# EasyEDA Pro project ProPrj_OrcaSDVX_电路.epro, board PCB4
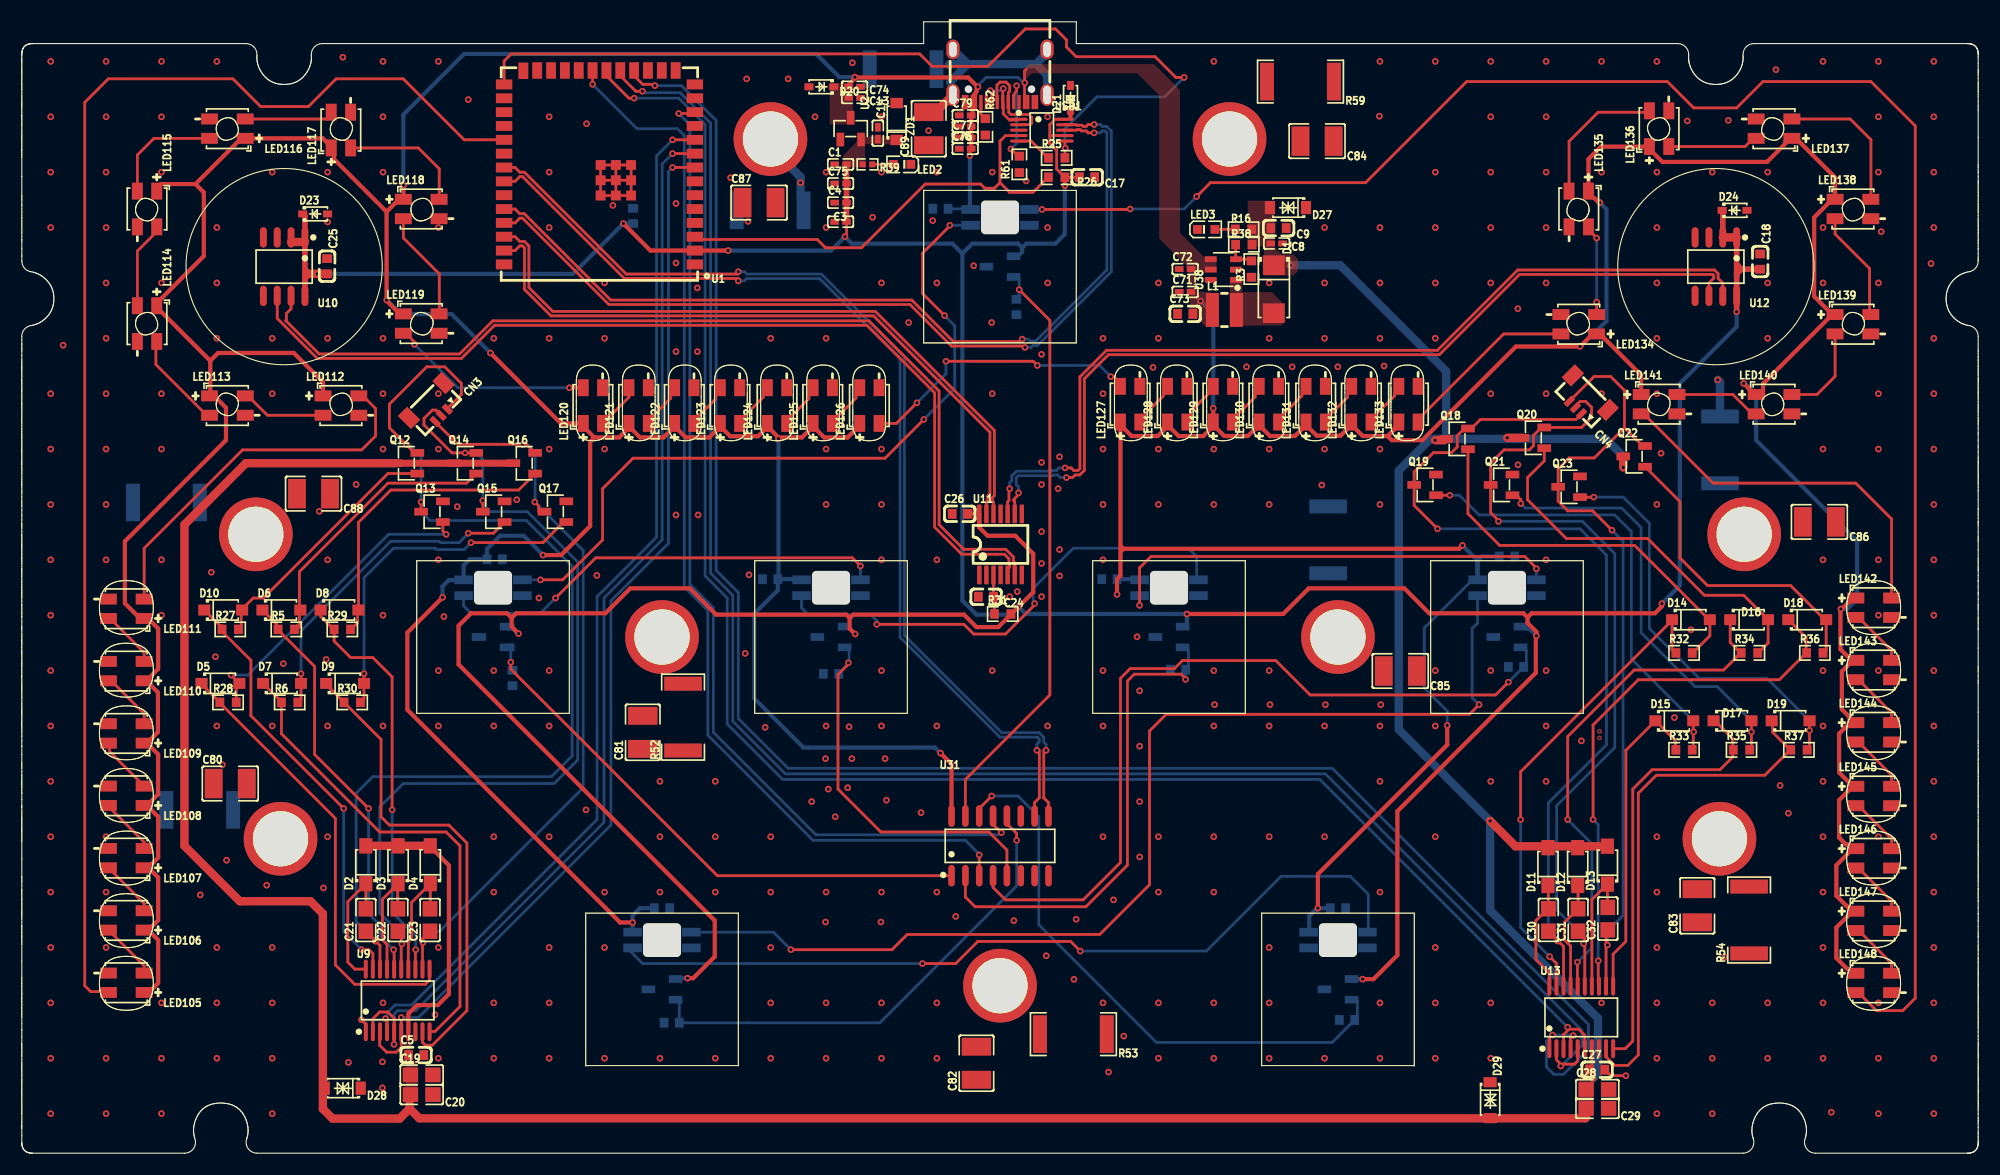
[diagram p3: board, top side]
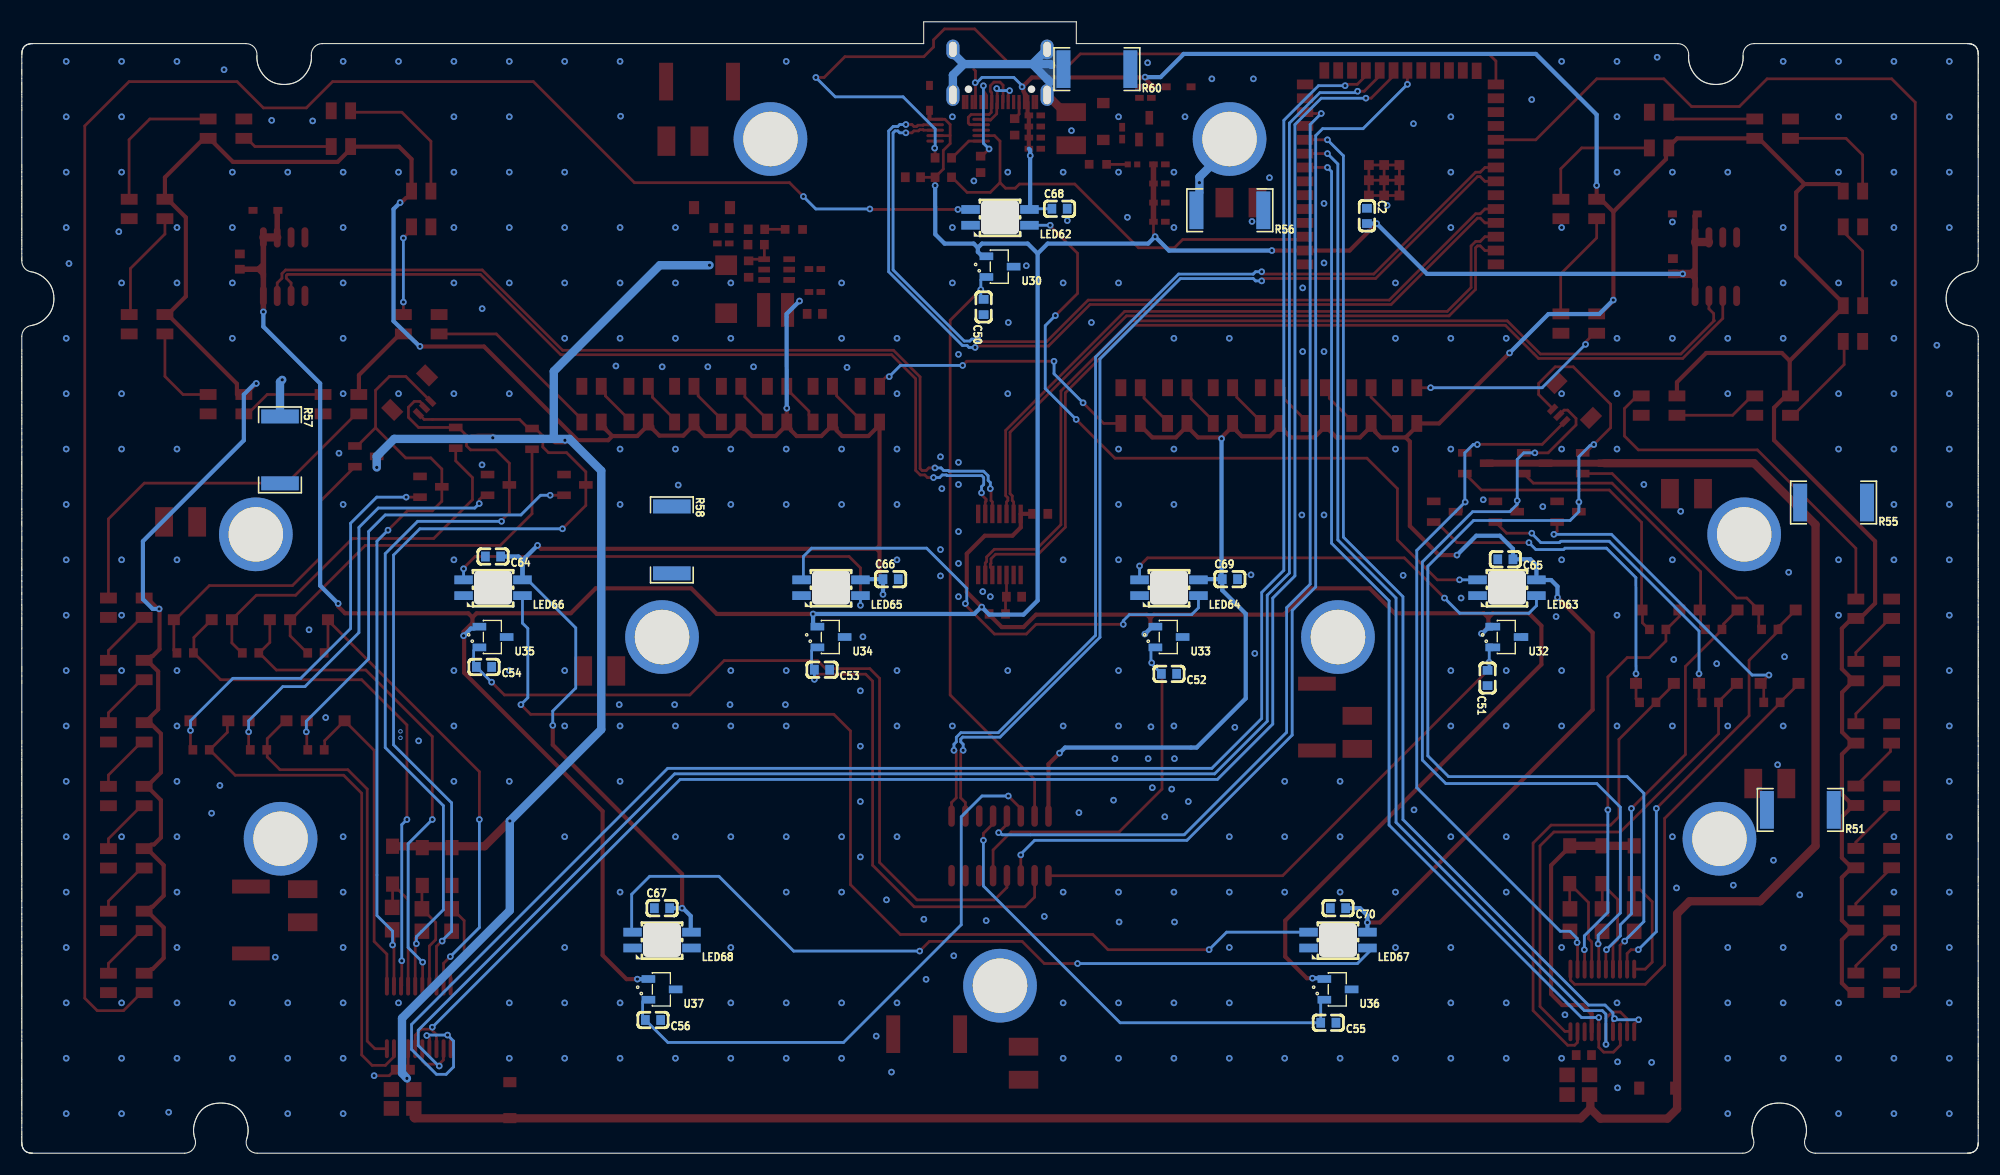
[diagram p4: board, bottom side, seen from below]

Outline 179.44 x 103.78 mm; copper layers: Top Layer, Bottom Layer. Coordinates in mm from the lower left corner of the outline.
Stack: Top Layer 0.035mm / Dielectric1 1.51mm FR4 er 4.5 / Bottom Layer 0.035mm

## Design rules (mm)
net SEL1: DP5
net SEL2: DP5
net RXD0: DP4
net TXD0: DP4
net SCL: DP1
net SDA: DP1
net SCL_0: DP3
net SDA_0: DP3
net SDA_1: DP2
net SCL_1: DP2
template: 自定义配置
spacing copperThickness1oz (default): track to track 0.102, other pairs 0.152 to 0.3
spacing copperThickness2oz: track to track 0.203, other pairs 0.152 to 0.3
track width copperThickness1oz (default): min 0.127, default 0.254, max 2.54
track width copperThickness2oz: min 0.203, default 0.254, max 2.54
differential pair differentialPair (default): width min 0.127, default 0.254, max 2.54; gap min 0.152, default 0.152
via viaSize (default): diameter min 0.5, default 0.61, max 10; hole min 0.3, default 0.305, max 6.299
net GND uses copperRegion2
net $1N114107 uses copperRegion2
net $1N114116 uses copperRegion2
net $1N114121 uses copperRegion2
net $1N114146 uses copperRegion2
net $1N114126 uses copperRegion2
net $1N114131 uses copperRegion2
net $1N114136 uses copperRegion2
net $1N114141 uses copperRegion2
pour e437 uses copperRegion2

## Placement (name value [footprint] x y rotation side)
C1  100nF  [C0402]  75.1 90.7 0 top
C2  100nF  [C0603]  56.06 85.98 270 bottom
C3  100nF  [C0402]  75.1 85.44 0 top
C4  100nF  [C0402]  75.1 87.19 0 top
C5  100nF  [C0603]  36.17 9 0 top
C8  100nF  [C0402]  115.1 83.45 180 top
C9  10uF  [C0603]  115.27 84.86 180 top
C13  100nF  [C0402]  76.38 96.8 180 top
C14  100nF  [C0402]  78.52 93.57 270 top
C17  100nF  [C0603]  97.71 89.52 180 top
C18  100nF  [C0603]  159.44 81.78 270 top
C19  22uF  [C0805]  36.68 7.18 0 top
C20  22uF  [C0805]  36.68 5.38 180 top
C21  22uF  [C0805]  31.55 21.39 90 top
C22  22uF  [C0805]  34.5 21.39 90 top
C23  22uF  [C0805]  37.44 21.39 90 top
C24  100nF  [C0603]  88.44 51.04 180 top
C25  100nF  [C0603]  28 81.36 270 top
C26  100nF  [C0603]  86.04 58.65 0 top
C27  100nF  [C0603]  144.49 7.66 0 top
C28  22uF  [C0805]  144.51 5.85 0 top
C29  22uF  [C0805]  144.51 4.11 180 top
C30  22uF  [C0805]  140.02 21.39 90 top
C31  22uF  [C0805]  142.74 21.39 90 top
C32  22uF  [C0805]  145.47 21.52 90 top
C50  100nF  [C0603]  91.23 77.62 90 bottom
C51  100nF  [C0603]  45 43.59 90 bottom
C52  100nF  [C0603]  74.22 43.97 0 bottom
C53  100nF  [C0603]  106.05 44.35 0 bottom
C54  100nF  [C0603]  137.05 44.6 0 bottom
C55  100nF  [C0603]  59.61 11.96 0 bottom
C56  100nF  [C0603]  121.55 12.22 0 bottom
C64  100nF  [C0603]  136.22 54.73 0 bottom
C65  100nF  [C0603]  43.37 54.48 0 bottom
C66  100nF  [C0603]  99.75 52.66 180 bottom
C67  100nF  [C0603]  120.72 22.48 180 bottom
C68  100nF  [C0603]  84.26 86.63 180 bottom
C69  100nF  [C0603]  68.64 52.66 180 bottom
C70  100nF  [C0603]  58.72 22.48 0 bottom
C71  100nF  [C0402]  106.7 79 0 top
C72  100nF  [C0402]  106.7 81.1 0 top
C73  10uF  [C0603]  106.71 76.99 0 top
C74  100nF  [C0402]  76.38 97.82 180 top
C75  100nF  [C0402]  75.1 88.95 0 top
C76  100nF  [C0402]  86.53 92.14 0 top
C77  100nF  [C0402]  86.53 93.16 0 top
C78  100nF  [C0402]  86.53 94.17 0 top
C79  100nF  [C0402]  86.53 95.19 0 top
C80  1.2nF  [C1210]  19.12 33.91 0 top
C81  1.2nF  [C1210]  56.95 38.61 90 top
C82  1.2nF  [C1210]  87.56 8.25 90 top
C83  1.2nF  [C1210]  153.68 22.7 90 top
C84  1.2nF  [C1210]  118.8 92.83 180 top
C85  1.2nF  [C1210]  126.44 44.23 180 top
C86  1.2nF  [C1210]  164.88 57.91 180 top
C87  1.2nF  [C1210]  67.62 87.19 0 top
C88  1.2nF  [C1210]  26.76 60.5 180 top
C89  1.2nF  [C1210]  83.19 93.98 90 top
CN3  -  [CONN-SMD_X0800WRS-03HF-LPV01]  37.78 68.37 225 top
CN4  -  [CONN-SMD_X0800WRS-03HF-LPV01]  143.19 69.09 135 top
D1  SS34  [SMA_L4.3-W2.6-LS5.2-RD]  114.84 79.25 270 top
D2  -  [SOD-123FL_L2.7-W1.8-LS3.8-RD]  31.55 26.46 90 top
D3  -  [SOD-123FL_L2.7-W1.8-LS3.8-RD]  34.51 26.46 90 top
D4  -  [SOD-123FL_L2.7-W1.8-LS3.8-RD]  37.47 26.46 90 top
D5  -  [SOD-123F_L2.7-W1.6-LS3.8-RD]  18.22 43.09 0 top
D6  -  [SOD-123F_L2.7-W1.6-LS3.8-RD]  23.81 49.83 0 top
D7  -  [SOD-123F_L2.7-W1.6-LS3.8-RD]  23.87 43.09 0 top
D8  -  [SOD-123F_L2.7-W1.6-LS3.8-RD]  29.14 49.83 0 top
D9  -  [SOD-123F_L2.7-W1.6-LS3.8-RD]  29.65 43.09 0 top
D10  -  [SOD-123F_L2.7-W1.6-LS3.8-RD]  18.47 49.83 0 top
D11  -  [SOD-123FL_L2.7-W1.8-LS3.8-RD]  139.98 26.29 90 top
D12  -  [SOD-123FL_L2.7-W1.8-LS3.8-RD]  142.71 26.29 90 top
D13  -  [SOD-123FL_L2.7-W1.8-LS3.8-RD]  145.43 26.42 90 top
D14  -  [SOD-123F_L2.7-W1.6-LS3.8-RD]  153.09 48.94 0 top
D15  -  [SOD-123F_L2.7-W1.6-LS3.8-RD]  151.57 39.67 0 top
D16  -  [SOD-123F_L2.7-W1.6-LS3.8-RD]  158.43 48.94 0 top
D17  -  [SOD-123F_L2.7-W1.6-LS3.8-RD]  156.9 39.67 0 top
D18  -  [SOD-123F_L2.7-W1.6-LS3.8-RD]  163.76 48.94 0 top
D19  -  [SOD-123F_L2.7-W1.6-LS3.8-RD]  162.24 39.67 0 top
D20  BZT52C9V1S  [SOD-323_L1.7-W1.3-LS2.6-RD]  73.34 97.82 180 top
D21  BZT52C6V2S  [SOD-323_L1.7-W1.3-LS2.6-RD]  96.19 96.8 90 top
D23  BZT52C6V2S  [SOD-323_L1.7-W1.3-LS2.6-RD]  26.91 86.16 0 top
D24  BZT52C6V2S  [SOD-323_L1.7-W1.3-LS2.6-RD]  157.09 86.48 0 top
D27  SMF13CA  [SOD-123_L2.8-W1.8-LS3.7-BI-1]  116.14 86.74 180 top
D28  SMF13CA  [SOD-123_L2.8-W1.8-LS3.7-BI-1]  29.44 5.97 180 top
D29  SMF13CA  [SOD-123_L2.8-W1.8-LS3.7-BI-1]  134.68 4.87 270 top
L1  10uH  [IND-SMD_L3.0-W3.0_FTC303020D]  110.3 77.35 0 top
LED2  XL-1608UGC-04  [LED0603-RD_GREEN]  80.74 90.71 180 top
LED3  XL-1608UGC-04  [LED0603-RD_GREEN]  108.63 84.73 0 top
LED62  XL-6028RGBW-WS2812B  [LED-SMD_4P-L3.2-W2.8-XL-6028RGBW-WS2812B]  89.72 85.84 0 bottom
LED63  XL-6028RGBW-WS2812B  [LED-SMD_4P-L3.2-W2.8-XL-6028RGBW-WS2812B]  43.22 51.87 0 bottom
LED64  XL-6028RGBW-WS2812B  [LED-SMD_4P-L3.2-W2.8-XL-6028RGBW-WS2812B]  74.22 51.87 0 bottom
LED65  XL-6028RGBW-WS2812B  [LED-SMD_4P-L3.2-W2.8-XL-6028RGBW-WS2812B]  105.22 51.87 0 bottom
LED66  XL-6028RGBW-WS2812B  [LED-SMD_4P-L3.2-W2.8-XL-6028RGBW-WS2812B]  136.22 51.87 0 bottom
LED67  XL-6028RGBW-WS2812B  [LED-SMD_4P-L3.2-W2.8-XL-6028RGBW-WS2812B]  58.72 19.55 0 bottom
LED68  XL-6028RGBW-WS2812B  [LED-SMD_4P-L3.2-W2.8-XL-6028RGBW-WS2812B]  120.72 19.55 0 bottom
LED105  WS2812B-Mini  [LED-SMD_4P-L3.5-W3.5-TL_WS2812B]  9.58 15.63 180 top
LED106  WS2812B-Mini  [LED-SMD_4P-L3.5-W3.5-TL_WS2812B]  9.58 21.35 180 top
LED107  WS2812B-Mini  [LED-SMD_4P-L3.5-W3.5-TL_WS2812B]  9.58 27.07 180 top
LED108  WS2812B-Mini  [LED-SMD_4P-L3.5-W3.5-TL_WS2812B]  9.58 32.79 180 top
LED109  WS2812B-Mini  [LED-SMD_4P-L3.5-W3.5-TL_WS2812B]  9.58 38.5 180 top
LED110  WS2812B-Mini  [LED-SMD_4P-L3.5-W3.5-TL_WS2812B]  9.58 44.22 180 top
LED111  WS2812B-Mini  [LED-SMD_4P-L3.5-W3.5-TL_WS2812B]  9.58 49.94 180 top
LED112  WS2812B-Mini  [LED-SMD_4P-L3.5-W3.5-TL_WS2812B]  29.27 68.58 0 top
LED113  WS2812B-Mini  [LED-SMD_4P-L3.5-W3.5-TL_WS2812B]  18.85 68.58 0 top
LED114  WS2812B-Mini  [LED-SMD_4P-L3.5-W3.5-TL_WS2812B]  11.49 76.1 270 top
LED115  WS2812B-Mini  [LED-SMD_4P-L3.5-W3.5-TL_WS2812B]  11.49 86.61 270 top
LED116  WS2812B-Mini  [LED-SMD_4P-L3.5-W3.5-TL_WS2812B]  18.85 93.98 180 top
LED117  WS2812B-Mini  [LED-SMD_4P-L3.5-W3.5-TL_WS2812B]  29.27 93.85 90 top
LED118  WS2812B-Mini  [LED-SMD_4P-L3.5-W3.5-TL_WS2812B]  36.63 86.61 0 top
LED119  WS2812B-Mini  [LED-SMD_4P-L3.5-W3.5-TL_WS2812B]  36.63 76.1 0 top
LED120  WS2812B-Mini  [LED-SMD_4P-L3.5-W3.5-TL_WS2812B]  52.38 68.58 90 top
LED121  WS2812B-Mini  [LED-SMD_4P-L3.5-W3.5-TL_WS2812B]  56.57 68.58 90 top
LED122  WS2812B-Mini  [LED-SMD_4P-L3.5-W3.5-TL_WS2812B]  60.76 68.58 90 top
LED123  WS2812B-Mini  [LED-SMD_4P-L3.5-W3.5-TL_WS2812B]  64.95 68.58 90 top
LED124  WS2812B-Mini  [LED-SMD_4P-L3.5-W3.5-TL_WS2812B]  69.27 68.58 90 top
LED125  WS2812B-Mini  [LED-SMD_4P-L3.5-W3.5-TL_WS2812B]  73.46 68.58 90 top
LED126  WS2812B-Mini  [LED-SMD_4P-L3.5-W3.5-TL_WS2812B]  77.74 68.58 90 top
LED127  WS2812B-Mini  [LED-SMD_4P-L3.5-W3.5-TL_WS2812B]  101.66 68.7 90 top
LED128  WS2812B-Mini  [LED-SMD_4P-L3.5-W3.5-TL_WS2812B]  105.98 68.7 90 top
LED129  WS2812B-Mini  [LED-SMD_4P-L3.5-W3.5-TL_WS2812B]  110.17 68.7 90 top
LED130  WS2812B-Mini  [LED-SMD_4P-L3.5-W3.5-TL_WS2812B]  114.38 68.7 90 top
LED131  WS2812B-Mini  [LED-SMD_4P-L3.5-W3.5-TL_WS2812B]  118.68 68.7 90 top
LED132  WS2812B-Mini  [LED-SMD_4P-L3.5-W3.5-TL_WS2812B]  122.87 68.7 90 top
LED133  WS2812B-Mini  [LED-SMD_4P-L3.5-W3.5-TL_WS2812B]  127.19 68.7 90 top
LED134  WS2812B-Mini  [LED-SMD_4P-L3.5-W3.5-TL_WS2812B]  142.81 76.04 180 top
LED135  WS2812B-Mini  [LED-SMD_4P-L3.5-W3.5-TL_WS2812B]  142.81 86.61 270 top
LED136  WS2812B-Mini  [LED-SMD_4P-L3.5-W3.5-TL_WS2812B]  150.17 93.98 90 top
LED137  WS2812B-Mini  [LED-SMD_4P-L3.5-W3.5-TL_WS2812B]  160.71 93.98 180 top
LED138  WS2812B-Mini  [LED-SMD_4P-L3.5-W3.5-TL_WS2812B]  167.95 86.61 0 top
LED139  WS2812B-Mini  [LED-SMD_4P-L3.5-W3.5-TL_WS2812B]  167.95 76.04 0 top
LED140  WS2812B-Mini  [LED-SMD_4P-L3.5-W3.5-TL_WS2812B]  160.71 68.7 0 top
LED141  WS2812B-Mini  [LED-SMD_4P-L3.5-W3.5-TL_WS2812B]  150.17 68.7 0 top
LED142  WS2812B-Mini  [LED-SMD_4P-L3.5-W3.5-TL_WS2812B]  169.86 50.03 0 top
LED143  WS2812B-Mini  [LED-SMD_4P-L3.5-W3.5-TL_WS2812B]  169.86 44.32 0 top
LED144  WS2812B-Mini  [LED-SMD_4P-L3.5-W3.5-TL_WS2812B]  169.86 38.61 0 top
LED145  WS2812B-Mini  [LED-SMD_4P-L3.5-W3.5-TL_WS2812B]  169.86 32.76 0 top
LED146  WS2812B-Mini  [LED-SMD_4P-L3.5-W3.5-TL_WS2812B]  169.86 27.05 0 top
LED147  WS2812B-Mini  [LED-SMD_4P-L3.5-W3.5-TL_WS2812B]  169.86 21.31 0 top
LED148  WS2812B-Mini  [LED-SMD_4P-L3.5-W3.5-TL_WS2812B]  169.86 15.62 0 top
NOREF  -  [Pad_e518]  23.73 28.84 0 top
NOREF#2  -  [Pad_ie365]  44.85 48.3 270 top
NOREF#3  -  [Pad_e517]  21.46 56.77 0 top
NOREF#4  -  [Pad_e514]  157.98 56.77 0 top
NOREF#5  -  [Pad_e513]  155.71 28.84 0 top
NOREF#6  -  [Pad_e516]  68.67 93.03 0 top
NOREF#7  -  [Pad_ie363]  41.62 47.35 270 top
NOREF#8  -  [Pad_e511]  58.72 47.35 0 top
NOREF#9  -  [Pad_e515]  110.77 93.03 0 top
NOREF#10  -  [Pad_e175]  89.72 15.36 0 top
NOREF#11  -  [Pad_ie364]  44.85 46.4 270 top
NOREF#12  -  [Pad_e512]  120.72 47.35 0 top
Q12  -  [SOT-23-3_L2.9-W1.3-P0.95-LS2.4-BR]  35.27 63.29 0 top
Q13  -  [SOT-23-3_L2.9-W1.3-P0.95-LS2.4-BR]  37.62 58.84 0 top
Q14  -  [SOT-23-3_L2.9-W1.3-P0.95-LS2.4-BR]  40.68 63.29 0 top
Q15  -  [SOT-23-3_L2.9-W1.3-P0.95-LS2.4-BR]  43.28 58.84 0 top
Q16  -  [SOT-23-3_L2.9-W1.3-P0.95-LS2.4-BR]  46.08 63.29 0 top
Q17  -  [SOT-23-3_L2.9-W1.3-P0.95-LS2.4-BR]  48.94 58.84 0 top
Q18  -  [SOT-23-3_L2.9-W1.3-P0.95-LS2.4-BR]  131.64 65.52 0 top
Q19  -  [SOT-23-3_L2.9-W1.3-P0.95-LS2.4-BR]  128.71 61.3 0 top
Q20  -  [SOT-23-3_L2.9-W1.3-P0.95-LS2.4-BR]  138.64 65.62 0 top
Q21  -  [SOT-23-3_L2.9-W1.3-P0.95-LS2.4-BR]  135.72 61.3 0 top
Q22  -  [SOT-23-3_L2.9-W1.3-P0.95-LS2.4-BR]  147.89 63.92 0 top
Q23  -  [SOT-23-3_L2.9-W1.3-P0.95-LS2.4-BR]  141.92 61.13 0 top
R3  2kΩ  [R0603]  112.78 81.1 90 top
R5  10Ω  [R0603]  24.26 48.05 0 top
R6  10Ω  [R0603]  24.57 41.35 0 top
R16  30kΩ  [R0603]  112.06 84.75 0 top
R25  -  [R0603]  94.92 91.3 0 top
R26  10kΩ  [R0603]  94.92 89.52 180 top
R27  10Ω  [R0603]  19.12 48.05 0 top
R28  10Ω  [R0603]  18.92 41.35 0 top
R29  10Ω  [R0603]  29.4 48.05 0 top
R30  10Ω  [R0603]  30.31 41.35 0 top
R31  -  [R0603]  89.97 49.46 0 top
R32  10Ω  [R0603]  152.46 45.89 0 top
R33  10Ω  [R0603]  152.46 37 0 top
R34  10Ω  [R0603]  158.46 45.89 0 top
R35  10Ω  [R0603]  157.73 37 0 top
R36  10Ω  [R0603]  164.46 45.89 0 top
R37  10Ω  [R0603]  163 37 0 top
R38  30kΩ  [R0603]  112.09 83.34 0 top
R39  10kΩ  [R0402]  77.57 90.7 180 top
R51  1MΩ  [R2512]  16.31 31.49 0 bottom
R52  1MΩ  [R2512]  60.65 40 90 top
R53  1MΩ  [R2512]  96.45 10.92 180 top
R54  1MΩ  [R2512]  158.43 21.39 90 top
R55  1MΩ  [R2512]  13.27 59.69 0 bottom
R56  1MΩ  [R2512]  68.64 86.49 0 bottom
R57  1MΩ  [R2512]  155.76 64.51 270 bottom
R58  1MΩ  [R2512]  119.82 56.26 270 bottom
R59  1MΩ  [R2512]  117.28 98.3 180 top
R60  1MΩ  [R2512]  80.83 99.44 0 bottom
R61  5.1kΩ  [R0603]  91.5 90.7 90 top
R62  5.1kΩ  [R0603]  88.37 94.14 270 top
U1  ESP32-S3-WROOM-1U-N16R8  [WIRELM-SMD_ESP32-S3-WROOM-1U]  52.99 90.42 180 top
U2  XC6206P332MR  [SOT-23-3_L2.9-W1.3-P1.90-LS2.4-BR]  76.03 93.98 270 top
U8  CH340X  [MSOP-10_L3.0-W3.0-P0.50-LS5.0-BL]  93.56 93.84 270 top
U9  -  [TSSOP-20_L6.5-W4.4-P0.65-LS6.4-BL]  34.48 14.01 0 top
U10  -  [SOP-8_L4.9-W3.9-P1.27-LS6.0-BL]  24.06 81.32 180 top
U11  PCA9543APWR  [TSSOP-14_L5.0-W4.4-P0.65-LS6.4-BL]  89.77 55.84 0 top
U12  -  [SOP-8_L4.9-W3.9-P1.27-LS6.0-BL]  155.38 81.32 180 top
U13  -  [TSSOP-20_L6.5-W4.4-P0.65-LS6.4-BL]  143.03 12.46 0 top
U30  SLSS49E-3  [SOT-23-3_L2.9-W1.6-P1.90-LS2.8-BR-CW]  89.72 81.32 0 bottom
U31  RS2252XS16  [SOIC-16_L9.9-W3.9-P1.27-LS6.0-BL]  89.72 28.19 0 top
U32  SLSS49E-3  [SOT-23-3_L2.9-W1.6-P1.90-LS2.8-BR-CW]  43.22 47.35 0 bottom
U33  SLSS49E-3  [SOT-23-3_L2.9-W1.6-P1.90-LS2.8-BR-CW]  74.22 47.35 0 bottom
U34  SLSS49E-3  [SOT-23-3_L2.9-W1.6-P1.90-LS2.8-BR-CW]  105.22 47.35 0 bottom
U35  SLSS49E-3  [SOT-23-3_L2.9-W1.6-P1.90-LS2.8-BR-CW]  136.22 47.35 0 bottom
U36  SLSS49E-3  [SOT-23-3_L2.9-W1.6-P1.90-LS2.8-BR-CW]  58.72 15.03 0 bottom
U37  SLSS49E-3  [SOT-23-3_L2.9-W1.6-P1.90-LS2.8-BR-CW]  120.72 15.03 0 bottom
U38  MT3608  [SOT-23-6_L2.9-W1.6-P0.95-LS2.8-BL]  110.21 81.05 90 top
USB1  -  [USB-C-SMD_KH-TYPE-C-16P]  89.72 98.83 180 top
ZD1  BZT52C3V6  [SOD-123_L2.8-W1.8-LS3.7-RD]  80.25 94.64 90 top

## Footprints (pads in the part's own frame, mm; a bottom-side part is the same pattern mirrored in y, then rotated)
C0402
  rect 0.79x0.54 smd: 1(-0.545,0) 2(0.545,0)
C0603
  rect 0.8x0.9 smd: 1(-0.7,0) 2(0.7,0)
C0805
  rect 1.41x1.35 smd: 1(-1.03,0) 2(1.03,0)
C1210
  rect 1.635x2.7 smd: 1(-1.518,0) 2(1.518,0)
CONN-SMD_X0800WRS-03HF-LPV01
  rect 0.5x1 smd: 1(-0.8,0.973) 2(0,0.973) 3(0.8,0.973)
  rect 1.2x1.7 smd: 4(2.25,-0.95) 5(-2.25,-0.973)
IND-SMD_L3.0-W3.0_FTC303020D
  rect 1.2x3.1 smd: 1(-1.1,0) 2(1.1,0)
LED0603-RD_GREEN
  rect 0.8x0.8 smd: 1(-0.799,-0.004) 2(0.799,0.004)
LED-SMD_4P-L3.2-W2.8-XL-6028RGBW-WS2812B
  rect 1.7x0.8 smd: 1(2.7,0.725) 2(2.7,-0.725) 3(-2.7,-0.725) 4(-2.7,0.725)
LED-SMD_4P-L3.5-W3.5-TL_WS2812B
  rect 1.544x0.998 smd: 1(-1.639,0.889) 2(-1.639,-0.889) 3(1.639,-0.889) 4(1.639,0.889)
MSOP-10_L3.0-W3.0-P0.50-LS5.0-BL
  oval 0.28x1.62 smd: 1(-1,-2.11) 2(-0.5,-2.11) 3(0,-2.11) 4(0.5,-2.11) 5(1,-2.11) 6(1,2.11) 7(0.5,2.11) 8(0,2.11) 9(-0.5,2.11) 10(-1,2.11)
Pad_e175
  round 6.76 hole 4.998: 1(0,0)
Pad_e511
  round 6.76 hole 4.998: 1(0,0)
Pad_e512
  round 6.76 hole 4.998: 1(0,0)
Pad_e513
  round 6.76 hole 4.998: 1(0,0)
Pad_e514
  round 6.76 hole 4.998: 1(0,0)
Pad_e515
  round 6.76 hole 4.998: 1(0,0)
Pad_e516
  round 6.76 hole 4.998: 1(0,0)
Pad_e517
  round 6.76 hole 4.998: 1(0,0)
Pad_e518
  round 6.76 hole 4.998: 1(0,0)
Pad_ie363
  rect 0.7x0.7 smd far side: 2(0,0)
Pad_ie364
  rect 0.7x0.7 smd far side: 1(0,0)
Pad_ie365
  rect 0.7x0.7 smd far side: 3(0,0)
R0402
  rect 0.566x0.54 smd: 1(-0.433,0) 2(0.433,0)
R0603
  rect 0.806x0.864 smd: 1(-0.753,0) 2(0.753,0)
R2512
  rect 1.282x3.456 smd: 1(-3.067,0) 2(3.067,0)
SMA_L4.3-W2.6-LS5.2-RD
  rect 1.8x2 smd: 1(-2.2,0) 2(2.2,0)
SOD-123_L2.8-W1.8-LS3.7-BI-1
  rect 0.93x1.2 smd: 1(-1.65,0) 2(1.65,0)
SOD-123_L2.8-W1.8-LS3.7-RD
  rect 0.95x1.15 smd: 1(-1.692,0) 2(1.692,0)
SOD-123F_L2.7-W1.6-LS3.8-RD
  rect 1.1x1 smd: 1(-1.735,0) 2(1.735,0)
SOD-123FL_L2.7-W1.8-LS3.8-RD
  rect 1.399x1.199 smd: 1(-1.735,0) 2(1.735,0)
SOD-323_L1.7-W1.3-LS2.6-RD
  rect 0.83x0.63 smd: 1(-1.14,0) 2(1.14,0)
SOIC-16_L9.9-W3.9-P1.27-LS6.0-BL
  oval 0.602x1.971 smd: 1(-4.445,-2.736) 2(-3.175,-2.736) 3(-1.905,-2.736) 4(-0.635,-2.736) 5(0.635,-2.736) 6(1.905,-2.736) 7(3.175,-2.736) 8(4.445,-2.736) 9(4.445,2.736) 10(3.175,2.736) 11(1.905,2.736) 12(0.635,2.736) 13(-0.635,2.736) 14(-1.905,2.736) 15(-3.175,2.736) 16(-4.445,2.736)
SOP-8_L4.9-W3.9-P1.27-LS6.0-BL
  oval 0.63x1.865 smd: 1(-1.905,-2.683) 2(-0.635,-2.683) 3(0.635,-2.683) 4(1.905,-2.683) 5(1.905,2.683) 6(0.635,2.683) 7(-0.635,2.683) 8(-1.905,2.683)
SOT-23-3_L2.9-W1.3-P0.95-LS2.4-BR
  rect 1.25x0.7 smd: 1(1,-0.95) 2(1,0.95) 3(-1,0)
SOT-23-3_L2.9-W1.3-P1.90-LS2.4-BR
  rect 1.25x0.7 smd: 1(1,-0.95) 2(1,0.95) 3(-1,0)
SOT-23-3_L2.9-W1.6-P1.90-LS2.8-BR-CW
  rect 1.25x0.7 smd: 1(1.25,-0.95) 2(-1.25,0) 3(1.25,0.95)
SOT-23-6_L2.9-W1.6-P0.95-LS2.8-BL
  rect 0.532x1.072 smd: 1(-0.95,-1.149) 2(0,-1.149) 3(0.95,-1.149) 4(0.95,1.149) 5(0,1.149) 6(-0.95,1.149)
TSSOP-14_L5.0-W4.4-P0.65-LS6.4-BL
  rect 0.4x1.7 smd: 1(-1.95,-2.8) 2(-1.3,-2.8) 3(-0.65,-2.8) 4(0,-2.8) 5(0.65,-2.8) 6(1.3,-2.8) 7(1.95,-2.8) 8(1.95,2.8) 9(1.3,2.8) 10(0.65,2.8) 11(0,2.8) 12(-0.65,2.8) 13(-1.3,2.8) 14(-1.95,2.8)
TSSOP-20_L6.5-W4.4-P0.65-LS6.4-BL
  oval 0.364x1.742 smd: 1(-2.925,-2.871) 2(-2.275,-2.871) 3(-1.625,-2.871) 4(-0.975,-2.871) 5(-0.325,-2.871) 6(0.325,-2.871) 7(0.975,-2.871) 8(1.625,-2.871) 9(2.275,-2.871) 10(2.925,-2.871) 11(2.925,2.871) 12(2.275,2.871) 13(1.625,2.871) 14(0.975,2.871) 15(0.325,2.871) 16(-0.325,2.871) 17(-0.975,2.871) 18(-1.625,2.871) 19(-2.275,2.871) 20(-2.925,2.871)
USB-C-SMD_KH-TYPE-C-16P
  oval 1.2x2 hole 0.7x1.7: 1(-4.32,1.765) 2(4.32,1.765)
  oval 1.2x1.8 hole 0.7x1.4: 3(-4.32,-2.415) 4(4.32,-2.415)
  rect 0.3x1.3 smd: A1(-3.35,2.415) A4(-2.55,2.415) A5(-1.25,2.415) A6(-0.25,2.415) A7(0.25,2.415) A8(1.25,2.415) A9(2.55,2.415) A12(3.35,2.415) B1(3.05,2.415) B4(2.25,2.415) B5(1.75,2.415) B6(0.75,2.415) B7(-0.75,2.415) B8(-1.75,2.415) B9(-2.25,2.415) B12(-3.05,2.415)
WIRELM-SMD_ESP32-S3-WROOM-1U
  rect 1.5x0.9 smd: 1(-8.75,8.895) 2(-8.75,7.625) 3(-8.75,6.355) 4(-8.75,5.085) 5(-8.75,3.815) 6(-8.75,2.545) 7(-8.75,1.275) 8(-8.75,0.005) 9(-8.75,-1.265) 10(-8.75,-2.535) 11(-8.75,-3.805) 12(-8.75,-5.075) 13(-8.75,-6.345) 14(-8.75,-7.615) 27(8.75,-7.615) 28(8.75,-6.345) 29(8.75,-5.075) 30(8.75,-3.805) 31(8.75,-2.535) 32(8.75,-1.265) 33(8.75,0.005) 34(8.75,1.275) 35(8.75,2.545) 36(8.75,3.815) 37(8.75,5.085) 38(8.75,6.355) 39(8.75,7.625) 40(8.75,8.895)
  rect 0.9x1.5 smd: 15(-6.985,-8.895) 16(-5.715,-8.895) 17(-4.445,-8.895) 18(-3.175,-8.895) 19(-1.905,-8.895) 20(-0.635,-8.895) 21(0.635,-8.895) 22(1.905,-8.895) 23(3.175,-8.895) 24(4.445,-8.895) 25(5.715,-8.895) 26(6.985,-8.865)
  rect 0.9x0.9 smd: 41(-2.9,2.575) 41(-2.9,1.175) 41(-2.9,-0.225) 41(-1.5,2.575) 41(-1.5,1.175) 41(-1.5,-0.225) 41(-0.1,2.575) 41(-0.1,1.175) 41(-0.1,-0.225)

## Nets
As in the schematic, except:
+3.3V: C1.2 C2.2 C3.2 C4.2 C14.2 C17.2 C18.2 C25.2 C26.2 C75.2 D21.1 D23.1 D24.1 NOREF#2.3 R26.1 R31.2 R39.2 U1.2 U2.2 U8.7 U8.10 U10.1 U10.2 U10.8 U11.14 U12.1 U12.2 U12.8 U30.1 U32.1 U33.1 U34.1 U35.1 U36.1 U37.1 ZD1.1
GND: C1.1 C2.1 C3.1 C4.1 C5.2 C8.1 C9.1 C13.1 C14.1 C17.1 C18.1 C19.2 C20.1 C24.2 C25.1 C26.1 C27.2 C28.2 C29.1 C50.1 C51.1 C52.1 C53.1 C54.1 C55.1 C56.1 C64.2 C65.2 C66.2 C67.1 C68.2 C69.2 C70.2 C71.1 C72.1 C73.1 C74.1 C75.1 C76.1 C77.1 C78.1 C79.1 C80.1 C81.1 C82.1 C83.1 C84.1 C85.1 C86.1 C87.1 C88.1 C89.1 CN3.4 CN3.5 CN4.4 CN4.5 D20.2 D21.2 D23.2 D24.2 D27.1 D28.1 D29.1 LED2.1 LED3.1 LED62.1 LED63.1 LED64.1 LED65.1 LED66.1 LED67.1 LED68.1 LED105.3 LED106.3 LED107.3 LED108.3 LED109.3 LED110.3 LED111.3 LED112.3 LED113.3 LED114.3 LED115.3 LED116.3 LED117.3 LED118.3 LED119.3 LED120.3 LED121.3 LED122.3 LED123.3 LED124.3 LED125.3 LED126.3 LED127.3 LED128.3 LED129.3 LED130.3 LED131.3 LED132.3 LED133.3 LED134.3 LED135.3 LED136.3 LED137.3 LED138.3 LED139.3 LED140.3 LED141.3 LED142.3 LED143.3 LED144.3 LED145.3 LED146.3 LED147.3 LED148.3 NOREF#7.2 Q13.2 Q15.2 Q17.2 Q19.2 Q21.2 Q23.2 R3.1 R51.1 R52.1 R53.1 R54.1 R55.1 R56.1 R57.1 R58.1 R59.1 R60.1 R61.1 R62.2 U1.1 U1.40 U1.41 U2.1 U8.3 U9.8 U10.4 U11.1 U11.2 U11.7 U12.4 U13.8 U30.2 U31.6 U31.8 U32.2 U33.2 U34.2 U35.2 U36.2 U37.2 U38.2 USB1.A1 USB1.A12 USB1.B1 USB1.B12 ZD1.2
BT_1: C51.2 NOREF#11.1 U31.1 U32.3
$1N114107: C80.2 NOREF.1 R51.2
$1N114111: C81.2 NOREF#8.1 R52.2
$1N114116: C82.2 NOREF#10.1 R53.2
$1N114121: C83.2 NOREF#5.1 R54.2
$1N114126: C85.2 NOREF#12.1 R58.2
$1N114131: C86.2 NOREF#4.1 R57.2
$1N114136: C87.2 NOREF#6.1 R56.2
$1N114141: C88.2 NOREF#3.1 R55.2
$1N114146: C84.2 NOREF#9.1 R59.2

Pads without a net: LED68 4; U1 4 5 6 7 13 14 15 16 17 22 23 24 25 26 28 29 30 32 35; U10 3 5; U11 4 8 11; U12 3 5; U31 7 11; U38 6; USB1 A8 B8

## Via types
v1: diameter 0.61, hole 0.305, Top Layer to Bottom Layer, 577 vias
v2: diameter 0.4, hole 0.25, Top Layer to Bottom Layer, 2 vias

## Routing (per net, layer and track width the routed paths; a pad name or vN(x,y) marks a point on that pad's centre or on a via; arc(x,y) is an arc through that point)
5V: length 1.3
  Top Layer w0.381: v1(100.45,51.26) 100.45,52.58
  vias: v1(33.47,78.26) v1(35,88.77) v1(38.59,50.98) v1(42.98,73.4) v1(47.81,54.86) v1(56.02,21.16) v1(69.4,65.54) v1(76.41,98.71) v1(84.26,36.7) v1(86.95,91.5) v1(87.7,97.82) v1(91.99,98.2) v1(108.11,78.17) v1(109.28,68.34) v1(118.88,22.48) v1(130.74,39.24) v1(132.14,55.75) v1(142.92,74.01) v1(144.74,87.2) v1(157.93,70.61) v1(166.84,49.92)
12V:
  vias: v1(116.36,81.45) v1(129.63,65.4) v1(134.68,30.48) v1(136.24,65.62) v1(144.12,6.86) v1(146.89,62.9)
+3.3V:
  vias: v1(27.11,80.66) v1(45.56,47.66) v1(55.18,85.28) v1(61.06,16.05) v1(64.78,82.8) v1(75.5,84.07) v1(76.44,47.62) v1(91.4,50.1) v1(95.67,88.76) v1(106.87,49.46) v1(122.98,15.97) v1(138.92,47.46) v1(150.43,50.42) v1(157.28,77.18)
GND:
  vias: v1(2.65,100.15) v1(2.65,95.07) v1(2.65,89.99) v1(2.65,84.91) v1(2.65,69.67) v1(2.65,64.59) v1(2.65,59.51) v1(2.65,54.43) v1(2.65,49.35) v1(2.65,44.27) v1(2.65,39.19) v1(2.65,34.11) v1(2.65,29.03) v1(2.65,23.95) v1(2.65,18.87) v1(2.65,13.79) v1(2.65,8.71) v1(2.65,3.63) v1(3.79,74.11) v1(7.73,100.15) v1(7.73,95.07) v1(7.73,89.99) v1(7.73,84.91) v1(7.73,79.83) v1(7.73,74.75) v1(7.73,69.67) v1(7.73,64.59) v1(7.73,59.51) v1(7.73,54.43) v1(7.73,29.03) v1(7.73,23.95) v1(7.73,18.87) v1(7.73,8.71) v1(7.73,3.63) v1(12.81,100.15) v1(12.81,95.07) v1(12.81,89.99) v1(12.81,79.83) v1(12.81,69.67) v1(12.81,64.59) v1(12.81,54.43) v1(12.81,49.35) v1(12.81,13.79) v1(12.81,8.71) v1(12.81,3.63) v1(16.37,23.69) v1(17.38,53.29) v1(17.76,45.54) v1(17.89,100.15) v1(17.89,84.91) v1(17.89,79.83) v1(17.89,74.75) v1(17.89,39.19) v1(17.89,18.87) v1(17.89,13.79) v1(17.89,8.71) v1(18.4,35.63) v1(18.78,26.87) v1(22.46,24.58) v1(22.97,89.99) v1(22.97,74.75) v1(22.97,69.67) v1(22.97,39.19) v1(22.97,18.87) v1(22.97,13.79) v1(22.97,8.71) v1(22.97,3.63) v1(23.98,44.9) v1(27.29,58.87) v1(27.67,24.33) v1(27.92,45.28) v1(28.05,89.99) v1(28.05,85.42) v1(28.05,74.75) v1(28.05,54.43) v1(28.05,39.19) v1(28.05,29.03) v1(29.45,100.53) v1(29.95,8.33) v1(30.66,61.34) v1(33.13,100.15) v1(33.13,95.07) v1(33.13,89.99) v1(33.13,74.75) v1(33.13,69.67) v1(33.13,64.59) v1(33.13,49.35) v1(33.13,39.19) v1(33.13,13.79) v1(33.08,8.38) v1(33.08,5.99) v1(37.9,12.7) v1(38.21,100.15) v1(38.21,84.91) v1(38.21,69.67) v1(38.21,64.59) v1(38.21,54.43) v1(38.21,44.27) v1(38.21,39.19) v1(38.21,18.87) v1(38.21,8.71) v1(38.72,49.22) v1(39.94,59.31) v1(40.95,96.64) v1(43.29,74.75) v1(43.29,44.27) v1(43.29,39.19) v1(43.29,29.03) v1(43.29,23.95) v1(43.29,13.79) v1(43.29,8.71) v1(45.4,59.94) v1(47.43,50.92) v1(48.37,95.07) v1(48.37,89.99) v1(48.37,84.91) v1(48.37,74.75) v1(48.37,64.59) v1(48.37,44.27) v1(48.37,39.19) v1(48.37,29.03) v1(48.37,18.87) v1(48.37,13.79) v1(48.37,8.71) v1(51.8,94.43) v1(51.75,31.49) v1(52.74,53) v1(53.45,79.83) v1(53.45,74.75) v1(53.45,64.59) v1(53.45,23.95) v1(53.45,18.87) v1(53.45,8.71) v1(54.21,86.94) v1(58.53,34.11) v1(58.53,29.03) v1(58.53,23.95) v1(58.53,8.71) v1(60,87.12) v1(60,81.66) v1(60,73.53) v1(60,58.54) v1(61.96,79.37) v1(61.96,73.53) v1(62.03,58.54) v1(63.61,34.11) v1(63.61,29.03) v1(63.61,23.95) v1(63.61,8.71) v1(65.01,89.48) v1(66.35,45.84) v1(66.48,98.55) v1(66.61,85.47) v1(66.7,53.06) v1(68.18,39.06) v1(68.69,74.75) v1(68.69,29.03) v1(68.69,23.95) v1(68.69,18.87) v1(68.69,13.79) v1(68.69,8.71) v1(70.29,98.55) v1(72.45,32.26) v1(72.75,95.07) v1(73.72,36.19) v1(73.72,21.21) v1(73.77,89.99) v1(73.77,84.91) v1(73.77,74.75) v1(73.77,64.59) v1(73.77,59.51) v1(73.77,39.19) v1(73.77,23.95) v1(73.77,13.79) v1(73.77,8.71) v1(73.97,33.4) v1(74.61,30.86) v1(75.75,33.53) v1(75.88,39.11) v1(76.13,36.19) v1(76.18,100.02) v1(78.04,85.85) v1(78.8,21.21) v1(78.85,95.07) v1(78.85,89.99) v1(78.85,79.83) v1(78.85,64.59) v1(78.85,59.51) v1(78.85,54.43) v1(78.85,44.27) v1(78.85,39.19) v1(78.85,23.95) v1(78.85,13.79) v1(78.85,8.71) v1(79.18,36.19) v1(79.31,32.38) v1(81.34,76.2) v1(82.48,31.24) v1(83.17,93.8) v1(83.55,85.54) v1(83.93,89.99) v1(83.93,79.83) v1(83.93,54.43) v1(83.93,39.19) v1(83.93,23.95) v1(83.93,13.79) v1(83.93,8.71) v1(85.66,21.71) v1(87.31,81.4) v1(89.01,89.99) v1(88.96,76.2) v1(89.01,69.67) v1(89.01,44.27) v1(90.61,51.05) v1(90.99,21.33) v1(91.3,51.52) v1(92.12,89.19) v1(93.53,73.28) v1(93.53,63.37) v1(93.53,61.34) v1(93.53,57.02) v1(93.53,54.1) v1(93.53,51.05) v1(93.96,18.11) v1(94.09,95.07) v1(94.09,84.91) v1(94.09,79.83) v1(94.09,39.19) v1(95.05,60.96) v1(95.18,63.88) v1(95.18,55.37) v1(95.18,52.96) v1(96.5,15.95) v1(96.71,21.46) v1(99.17,74.75) v1(99.17,69.67) v1(99.17,64.59) v1(99.17,59.51) v1(99.17,54.43) v1(99.17,44.27) v1(99.17,39.19) v1(99.17,29.03) v1(99.17,13.79) v1(99.68,7.44) v1(100.13,23.24) v1(101.07,10.74) v1(102.29,47.37) v1(102.53,42.42) v1(102.53,37.34) v1(102.53,32.26) v1(102.53,27.18) v1(103.75,72.08) v1(104.25,79.83) v1(104.25,74.75) v1(104.25,64.59) v1(104.25,59.51) v1(104.25,29.03) v1(104.25,23.95) v1(104.25,13.79) v1(104.25,8.71) v1(109.33,100.15) v1(109.33,64.59) v1(109.33,59.51) v1(109.33,44.27) v1(109.33,39.19) v1(109.33,29.03) v1(109.33,23.95) v1(109.33,13.79) v1(109.33,8.71) v1(109.41,41.15) v1(112.33,72.13) v1(114.41,79.83) v1(114.41,74.75) v1(114.41,64.59) v1(114.41,59.51) v1(114.41,44.27) v1(114.41,39.19) v1(114.41,29.03) v1(114.41,18.87) v1(114.41,13.79) v1(114.41,8.71) v1(114.49,41.15) v1(116.52,72.13) v1(119.24,61.29) v1(119.49,84.91) v1(119.49,79.83) v1(119.49,74.75) v1(119.49,64.59) v1(119.49,39.19) v1(119.49,29.03) v1(119.49,8.71) v1(119.56,41.15) v1(120.71,72.13) v1(124.52,95.12) v1(124.57,100.15) v1(124.57,84.91) v1(124.57,79.83) v1(124.57,74.75) v1(124.57,64.59) v1(124.57,59.51) v1(124.57,39.19) v1(124.57,34.11) v1(124.57,23.95) v1(124.57,13.79) v1(124.57,8.71) v1(124.65,41.15) v1(124.95,72.21) v1(129.65,100.15) v1(129.65,89.99) v1(129.65,84.91) v1(129.65,79.83) v1(129.65,74.75) v1(129.65,44.27) v1(129.65,39.19) v1(129.65,29.03) v1(129.65,18.87) v1(129.65,13.79) v1(129.65,8.71) v1(134.73,100.15) v1(134.73,95.07) v1(134.73,89.99) v1(134.73,84.91) v1(134.73,79.83) v1(134.73,69.67) v1(134.73,44.27) v1(134.73,34.11) v1(134.73,13.79) v1(134.73,8.71) v1(137.22,77.47) v1(137.23,63.14) v1(139.81,100.15) v1(139.81,95.07) v1(139.81,89.99) v1(139.81,84.91) v1(139.81,79.83) v1(139.81,69.67) v1(139.81,54.43) v1(139.81,44.27) v1(139.81,39.19) v1(139.81,34.11) v1(143.05,37.82) v1(144.89,100.15) v1(144.89,89.99) v1(144.89,69.67) v1(144.89,13.79) v1(147.12,7.11) v1(149.97,100.15) v1(149.97,89.99) v1(149.97,84.91) v1(149.97,79.83) v1(149.97,74.75) v1(149.97,69.67) v1(149.97,59.51) v1(149.97,29.03) v1(149.97,23.95) v1(149.97,18.87) v1(149.97,13.79) v1(149.97,8.71) v1(149.97,3.63) v1(150.35,64.21) v1(151.57,39.96) v1(152.76,94.69) v1(153.09,48.01) v1(155.05,89.99) v1(155.05,13.79) v1(155.05,8.71) v1(155.05,3.63) v1(155.56,70.94) v1(156.19,17.98) v1(156.52,94.74) v1(160.13,89.99) v1(160.13,84.91) v1(160.13,79.83) v1(160.13,74.75) v1(160.13,13.79) v1(160.13,8.71) v1(160.89,99.39) v1(161.27,33.73) v1(162.03,31.19) v1(165.21,100.15) v1(165.21,84.91) v1(165.21,79.83) v1(165.21,64.59) v1(165.21,54.43) v1(165.21,44.27) v1(165.21,39.19) v1(165.21,34.11) v1(165.21,29.03) v1(165.21,23.95) v1(165.21,18.87) v1(165.21,13.79) v1(165.21,8.71) v1(165.97,3.76) v1(170.29,100.15) v1(170.29,95.07) v1(170.29,89.99) v1(170.29,79.83) v1(170.29,69.67) v1(170.29,64.59) v1(170.29,54.43) v1(170.29,49.35) v1(170.29,44.27) v1(170.29,29.03) v1(170.29,13.79) v1(170.29,8.71) v1(170.29,3.63) v1(170.54,84.53) v1(175.12,81.61) v1(175.37,100.15) v1(175.37,95.07) v1(175.37,89.99) v1(175.37,84.91) v1(175.37,74.75) v1(175.37,69.67) v1(175.37,64.59) v1(175.37,59.51) v1(175.37,54.43) v1(175.37,49.35) v1(175.37,44.27) v1(175.37,39.19) v1(175.37,34.11) v1(175.37,29.03) v1(175.37,23.95) v1(175.37,18.87) v1(175.37,13.79) v1(175.37,8.71) v1(175.37,3.63) v2(144.71,38.69) v2(144.71,38.1)
ADC1:
  vias: v1(60.26,95.37) v1(89.85,29.4)
ADC2: length 1.9
  Top Layer w0.254: v1(87.81,27.36) U31.3
  vias: v1(52.35,98.05)
BT_1:
  vias: v1(44.85,45.04)
BT_2:
  vias: v1(75.81,44.98)
BT_3:
  vias: v1(106.75,43.46)
BT_4:
  vias: v1(136.35,43.21)
D+:
  vias: v1(88.84,97.47) v1(90.02,97.66)
FX_L:
  vias: v1(91.24,28.7)
FX_R:
  vias: v1(88.96,32.76)
HO1_0:
  vias: v1(29.52,31.62) v1(31.17,18.67)
HO1_1:
  vias: v1(137.47,30.6) v1(140.14,18.03)
HO2_0:
  vias: v1(31.81,31.62) v1(34.09,18.67)
HO2_1:
  vias: v1(141.79,30.6) v1(142.68,17.52)
HO3_0:
  vias: v1(33.97,31.49) v1(36.13,18.67)
HO3_1:
  vias: v1(144.12,30.6) v1(144.59,17.65)
IO0:
  vias: v1(95.71,92.19) v1(106.61,98.68)
LED:
  vias: v1(93.58,86.57) v1(101.66,86.61) v1(107.75,87.75)
M0_IN1_0:
  vias: v1(31.15,12.24) v1(33.35,12.34) v1(59.69,92.96)
M0_IN1_1:
  vias: v1(58.07,97.92) v1(140.39,10.84) v1(142.3,10.79)
M0_IN2_0:
  vias: v1(34.14,9.98) v1(59.69,91.69)
M0_IN2_1:
  vias: v1(56.92,97.41) v1(141.16,8)
M0_IN3_0:
  vias: v1(34.8,12.44) v1(59.69,90.42)
M0_IN3_1:
  vias: v1(56.16,96.78) v1(141.79,11.55)
RXD0: length 79.8
  Top Layer w0.254: v1(98.36,93.6) 97.8,93.6 97.62,93.77 97.2,93.77 97.08,93.89 96.78,93.89 96.73,93.84 U8.8 ; 91.75,74.44 85.44,74.44 81.63,78.25 54.01,78.25 46.09,86.17 45.67,86.17 45.24,86.61 44.24,86.61
  Bottom Layer w0.254: v1(98.36,93.6) 98.91,93.6 99.09,93.77 99.35,93.77 99.53,93.59 99.53,81.03 93,74.5 92.49,74.5 92.31,74.67 v1(91.75,74.67)
SCL: length 62.4
  Top Layer w0.254: U11.12 89.12,59.74 89,59.87 89,60.12 89.2,60.32 89.2,66.3 78.29,77.21 48.7,77.21 46.51,79.4 46.51,83.22 46.09,83.63 45.67,83.63 45.24,84.07 44.24,84.07
SCL_0: length 89.6
  Top Layer w0.254: U10.7 24.7,77.45 24.26,77.02 24.26,76.43 24.22,76.39 24.22,76.36 27.27,73.31 40.16,73.31 43.2,76.35 77.7,76.35 84.13,69.91 84.13,57.66 86.39,55.39 90.24,55.39 90.95,54.69 90.95,54.27 91.07,54.14 U11.6
SCL_1: length 83.7
  Top Layer w0.254: v1(90.61,60.96) 90.54,60.89 90.54,59.87 90.42,59.74 U11.10 ; U12.7 156.01,79.83 155.58,80.26 155.58,80.68 155.25,81.02 137.21,81.02 129.84,73.65 99.49,73.65 97.05,71.21 97.05,62.8 96.87,62.62 96.49,62.62 96.25,62.86 v1(95.69,62.86)
  Bottom Layer w0.254: v1(95.69,62.86) 95.13,62.86 94.89,62.62 94.47,62.62 94.4,62.56 91.23,62.56 90.81,62.14 90.81,61.72 90.61,61.52 v1(90.61,60.96)
SDA: length 61.7
  Top Layer w0.254: U1.39 45.24,82.8 45.67,83.23 45.93,83.23 46.11,83.05 46.11,79.23 48.53,76.81 78.12,76.81 88.8,66.13 88.8,60.49 88.59,60.29 88.59,59.87 88.47,59.74 U11.13
SDA_0: length 47.7
  Top Layer w0.254: 80.41,73.07 83.73,69.75 83.73,57.43 86.21,54.94 90.12,54.94 90.54,54.52 90.54,54.1 90.59,54.05 90.59,53.74 90.42,53.57 U11.5 ; U10.6 23.43,76.58 27.1,72.9 40.32,72.9 40.75,73.33
SDA_1: length 82.5
  Top Layer w0.254: v1(91.42,60.58) 91.42,60.41 91,59.99 91,59.82 91.07,59.74 U11.9 ; U12.6 154.74,79.83 155.18,80.26 155.18,80.51 155.08,80.61 137.38,80.61 130.01,73.24 99.66,73.24 97.46,71.04 97.46,62.63 97.04,62.21 96.62,62.21 96.38,61.97 v1(95.82,61.97)
  Bottom Layer w0.254: v1(91.42,60.58) 91.42,61.14 91.22,61.34 91.22,61.97 91.4,62.15 94.57,62.15 94.63,62.21 95.02,62.21 95.26,61.97 v1(95.82,61.97)
SEL1: length 93.7
  Top Layer w0.254: U31.9 94.16,32.17 93.73,32.6 93.73,36.95 ; 65.72,80.64 55.44,80.64 46.09,89.98 45.67,89.98 45.24,90.42 U1.33
  Bottom Layer w0.254: v1(65.72,80.86) 66.28,80.86 66.49,80.64 73.34,80.64 80.96,73.02 80.96,47.5 89.88,38.57 93.31,38.57 93.73,38.15 93.73,37.73 93.95,37.51 v1(93.95,36.95)
SEL2: length 93
  Top Layer w0.254: 44.24,89.15 45.24,89.15 45.67,89.58 45.93,89.58 55.27,80.24 65.72,80.24 ; 93.33,36.95 93.33,32.6 92.9,32.17 U31.10
  Bottom Layer w0.254: v1(93.1,36.95) 93.1,37.51 93.32,37.73 93.32,37.99 93.14,38.17 89.71,38.17 80.55,47.33 80.55,72.85 73.17,80.23 66.49,80.23 66.28,80.01 v1(65.72,80.01)
START:
  vias: v1(91.48,79.21)
TXD0: length 80.9
  Top Layer w0.254: 91.75,74.04 85.28,74.04 81.47,77.85 53.85,77.85 45.93,85.77 45.67,85.77 45.24,85.34 U1.37 ; U8.9 96.73,94.34 96.78,94.29 97.25,94.29 97.37,94.18 97.62,94.18 97.8,94.36 v1(98.36,94.36)
  Bottom Layer w0.254: v1(98.36,94.36) 98.91,94.36 99.09,94.18 99.52,94.18 99.93,93.76 99.93,80.86 93.17,74.09 92.74,74.09 92.56,73.91 v1(92.01,73.91)
VS1_0:
  vias: v1(32.42,19.45) v1(35.26,65) v1(36.62,59.73)
VS1_1:
  vias: v1(129.85,57.27) v1(140.89,19.46)
VS2_0:
  vias: v1(34.86,19.2) v1(40.66,64.24) v1(42.28,59.86)
VS2_1:
  vias: v1(135.44,57.96) v1(143.25,19.22)
VS3_0:
  vias: v1(36.79,19.32) v1(45.94,65) v1(47.05,59.73)
VS3_1:
  vias: v1(145.43,19.1) v1(145.85,57.15)
$1N73687:
  vias: v1(90.72,92.12) v1(91.24,97.91)
$1N114136:
  vias: v1(71.43,89.02)
$4N3014:
  vias: v1(31.39,43.98) v1(41.21,56)
$4N3025:
  vias: v1(25.61,43.98) v1(40.94,56.87)
$4N3028:
  vias: v1(19.19,43.86) v1(38.92,56.77)
$4N3066:
  vias: v1(144.19,60.18) v1(163.97,38.78)
$4N3078:
  vias: v1(137.48,59.59) v1(158.64,38.65)
$4N3091:
  vias: v1(130.98,60.35) v1(153.35,38.65)
$5N3636:
  vias: v1(78.42,48.51) v1(92.9,50.42)
$5N3697:
  vias: v1(70.54,18.67) v1(133.66,41.15)
$5N3701:
  vias: v1(82.61,17.4) v1(97.09,18.54)
$5N3703:
  vias: v1(102.52,50.25) v1(138.92,53.61)
$5N3707:
  vias: v1(47.57,52.59) v1(82.74,67.31) v1(84.64,76.83) v1(85.12,85.12)
$5N3711:
  vias: v1(48.95,50.92) v1(76.92,53.86)
$5N7580:
  vias: v1(36.01,74.2) v1(50.22,70.22)
$5N8582:
  vias: v1(144.44,83.94) v1(144.44,78.07)
$5N8636:
  vias: v1(82.1,68.83) v1(84.77,72.64) v1(93.15,72.26) v1(99.88,71.23)

## Copper pours and planes (outline as drawn; the poured copper is in the pictures)
5V on Top Layer: 107.25,82.26 109.56,82.26 109.56,80.8 107.25,80.8
5V on Top Layer: 106.95,81.38 107.72,81.38 107.72,78.86 106.95,78.86
5V on Top Layer: 74.1,98.17 76.26,98.17 76.26,94.36 74.1,94.36
5V on Top Layer: 107.12,79 109.28,79 109.28,75.82 107.12,75.82
5V on Top Layer: 91.87,99.9 108.43,99.9 108.43,81.33 91.87,81.33
12V on Top Layer: 34.98,10.41 36.25,10.41 36.25,4.82 34.98,4.82
12V on Top Layer: 113.93,83.45 115.75,83.45 115.75,81.02 113.93,81.02
12V on Top Layer: 112.45,87.37 114.87,87.37 114.87,83.18 112.45,83.18
12V on Top Layer: 113.85,82.44 117.06,82.44 117.06,80.52 113.85,80.52
12V on Top Layer: 142.81,8.95 144.17,8.95 144.17,3.43 142.81,3.43
+3.3V on Top Layer: 76.69,93.25 80.8,93.25 80.8,92.55 76.69,92.55
+3.3V on Top Layer: 75.33,92.98 77.34,92.98 77.34,90.45 75.33,90.45
+3.3V on Top Layer: 86.93,59.43 87.94,59.43 87.94,57.91 86.93,57.91
GND on Top Layer: 85.7,97.05 86.8,97.05 86.8,94.93 85.7,94.93
GND on Top Layer: -5.66,106.93 183.7,106.93 183.7,-4.19 -5.66,-4.19
GND on Bottom Layer: -5.15,106.42 184.84,106.42 184.84,-5.34 -5.15,-5.34
$1N73594 on Bottom Layer: 84.26,101.25 85.4,101.25 85.4,96.81 84.26,96.81
$1N73594 on Bottom Layer: 84.39,100.96 86.51,100.96 86.51,98.68 84.39,98.68
$1N109096 on Top Layer: 110.8,80.39 111.94,80.39 111.94,75.82 110.8,75.82
$1N109096 on Top Layer: 111.44,78.99 115.74,78.99 115.74,75.91 111.44,75.91
$1N114107 on Top Layer: 21.01,26.79 19.89,27.91 19.89,35.31 22.02,35.31 26.35,30.99 22.16,26.79
$1N114107 on Bottom Layer: 21.65,26.41 18.85,29.21 18.85,33.27 24,33.27 26.22,31.05 26.22,30.99
$1N114111 on Top Layer: 58.1,39.37 58.1,41.53 58.99,42.42 62.41,42.42 62.41,48.13 61.27,49.53 55.43,46.78 55.43,39.49 55.56,39.37
$1N114116 on Top Layer: 94.03,15.88 92.13,17.78 88.58,17.78 86.16,15.36 86.16,8.89 93.59,8.89 94.03,9.32
$1N114121 on Top Layer: 160.21,23.75 155.46,23.75 155.06,23.35 152.35,23.35 152.35,28.72 156.92,28.72 158.55,30.35 160.21,28.7
$1N114126 on Top Layer: 122.87,49.9 125.66,47.1 125.66,42.97 120.78,42.97 119.06,44.7 119.06,46.09
$1N114126 on Bottom Layer: 117.26,47.35 117.26,52.94 118.04,53.72 122.74,53.72 124.01,52.45 124.01,46.99 123.76,46.73 117.87,46.73
$1N114131 on Top Layer: 157.92,60.2 163.13,60.2 164.14,59.18 164.14,56.64 160.97,53.46 158.43,53.46 157.28,54.61 157.92,55.24
$1N114131 on Bottom Layer: 155.38,54.61 154.11,55.88 154.11,61.97 157.79,61.97 160.21,59.56 160.21,55.75 159.06,54.61
$1N114136 on Top Layer: 65.34,92.2 68.38,89.15 68.38,85.85 69.91,85.85 71.94,87.88 71.94,92.83 65.97,92.83
$1N114136 on Bottom Layer: 72.32,94.1 70.92,95.5 70.92,84.83 71.05,84.71 72.32,85.98
$1N114141 on Top Layer: 23.81,54.61 25.96,56.76 25.96,61.89 22.08,61.89 18.47,58.29 22.16,54.61
$1N114141 on Bottom Layer: 15.67,61.42 21.51,61.42 24.19,58.73 24.19,58.55 19.62,53.97 15.86,57.73 15.77,57.73 15.77,61.32
$1N114146 on Top Layer: 108.77,95.5 113.22,99.95 114.87,99.95 114.87,95.94 118.04,92.76 118.04,91.44 116.39,89.79 111.18,89.79 108.77,92.2
